# EAGLE design PMB (EAGLE 6.6.0)
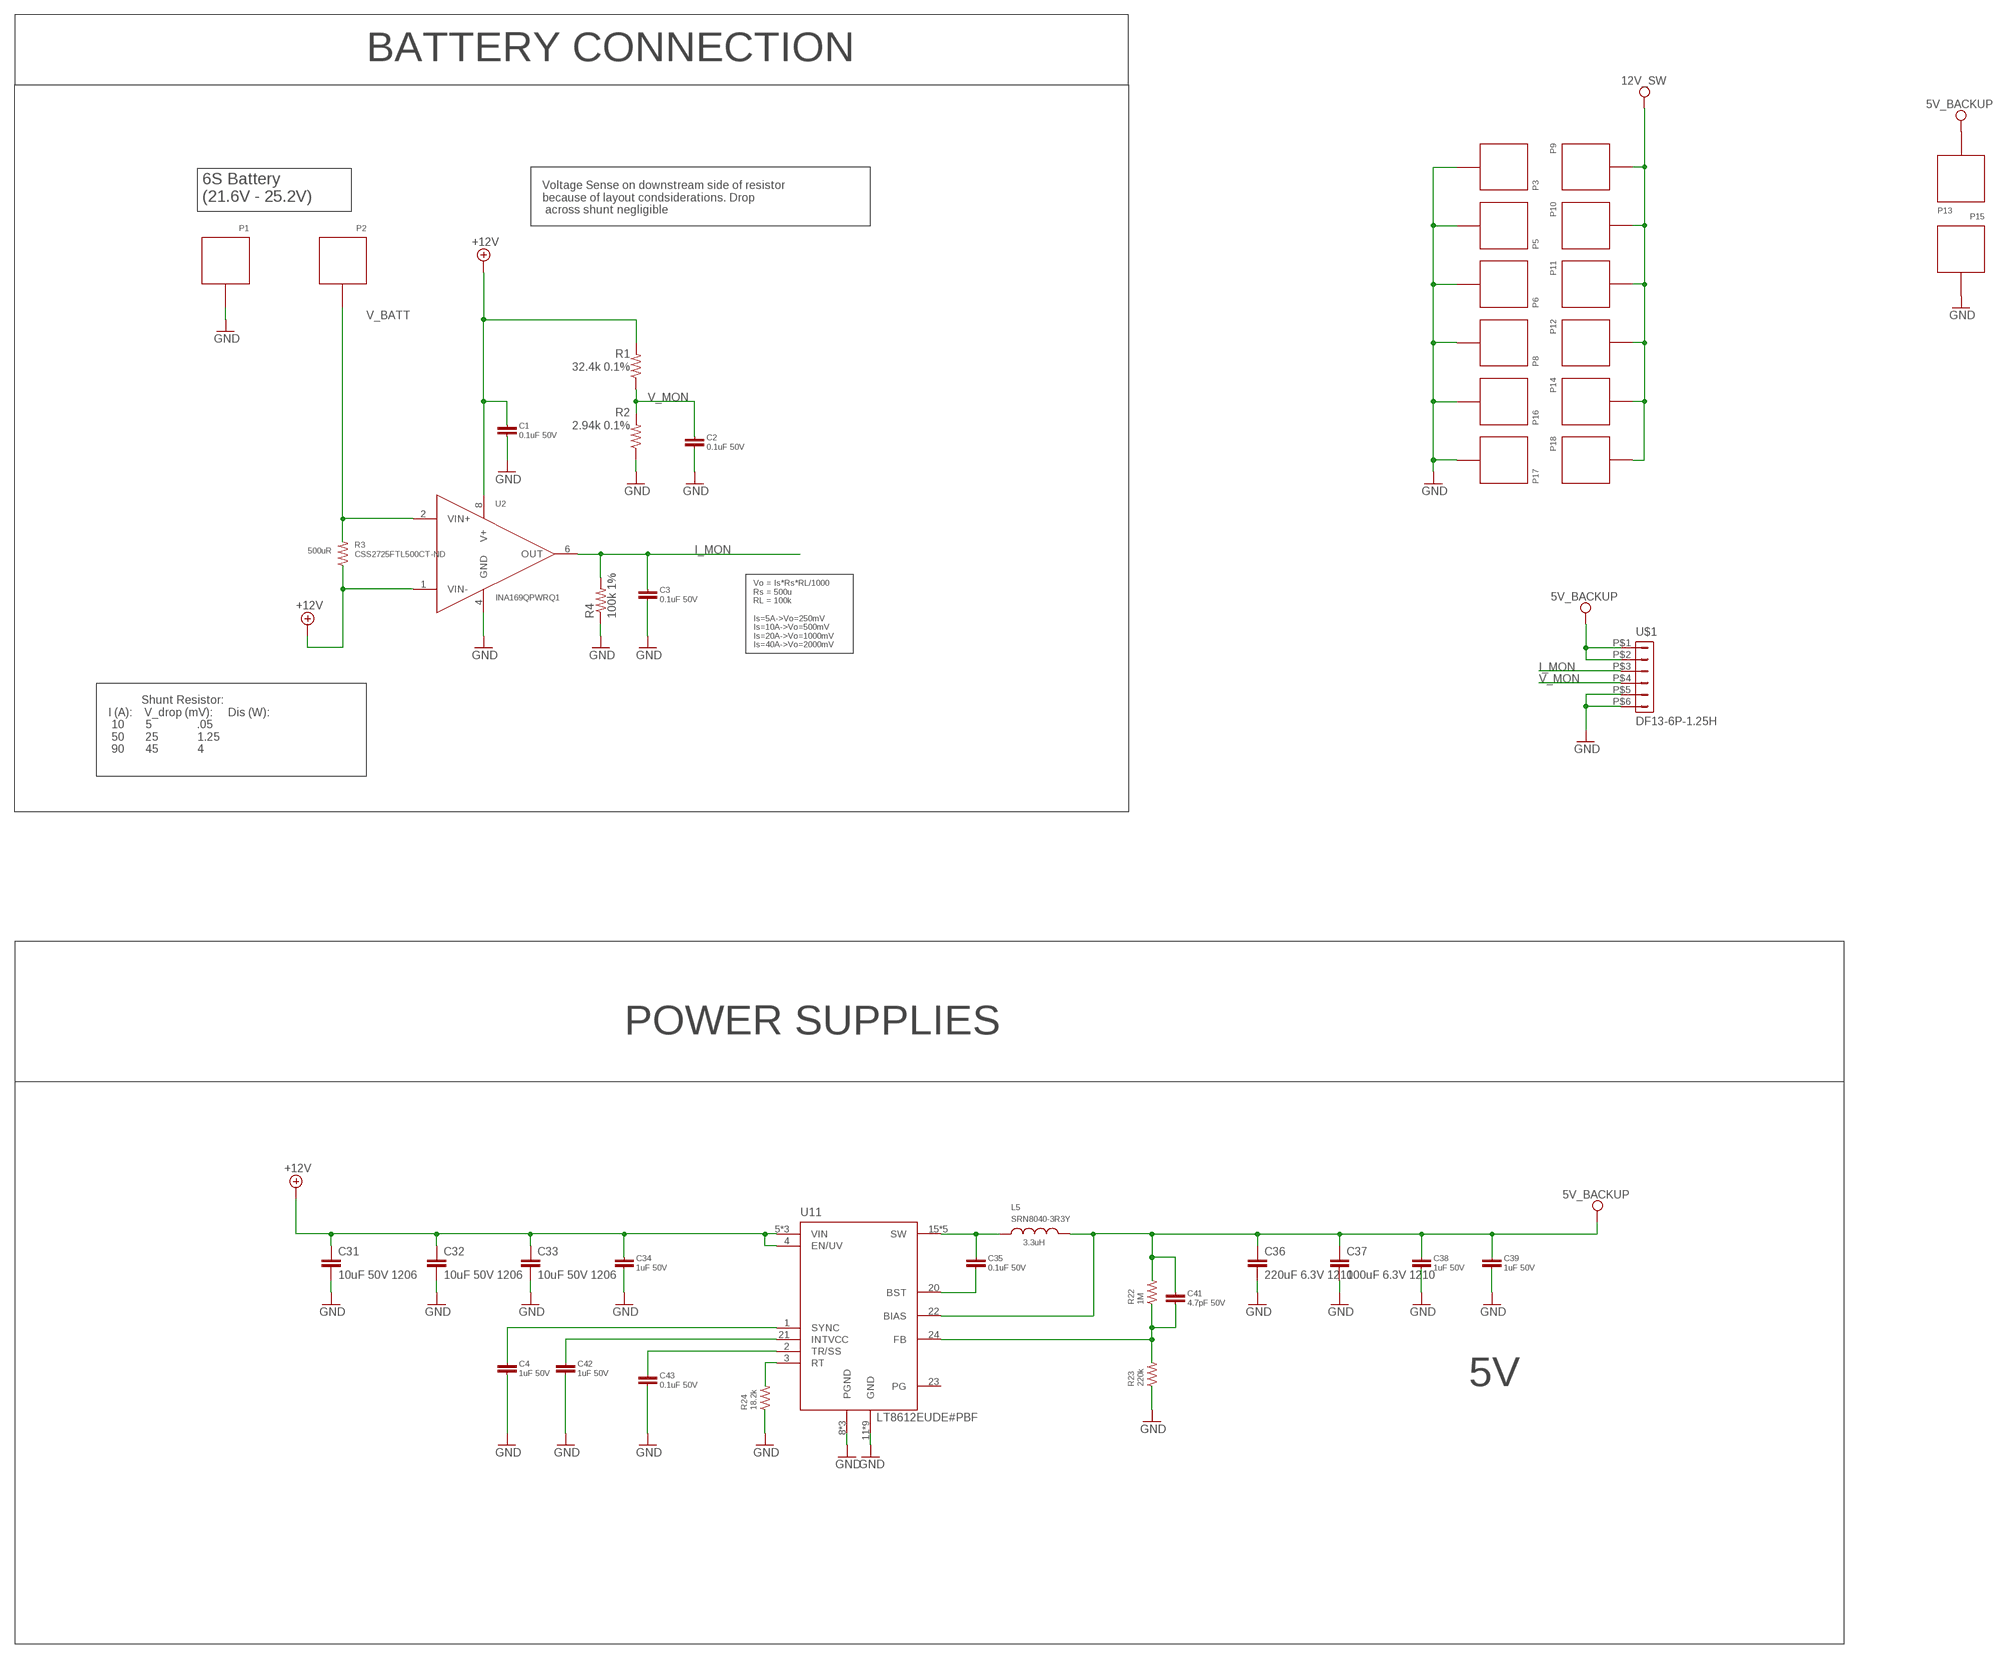
[diagram p0: schematic, sheet 1, part 1 of 2]
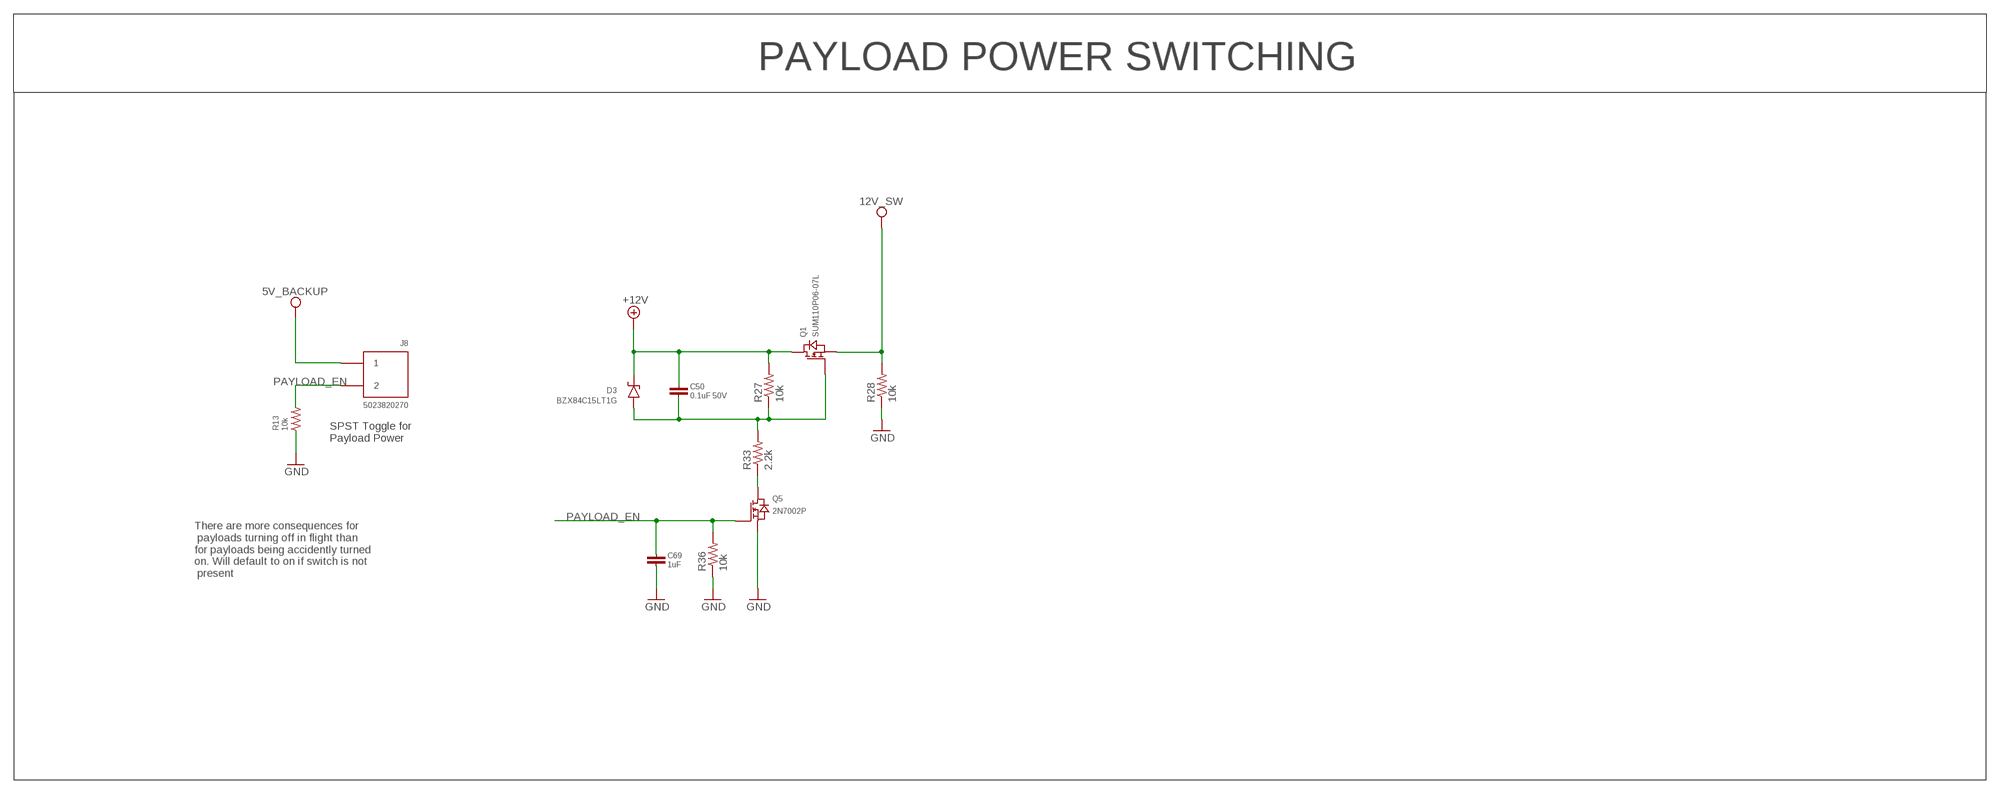
[diagram p1: schematic, sheet 1, part 2 of 2]

## Parts
C1  0.1uF 50V  CAP_(4)  [0805]
C2  0.1uF 50V  CAP_(4)  [0805]
C3  0.1uF 50V  CAP_(4)  [0805]
C4  1uF 50V  CAP_(4)  [0805]
C31  10uF 50V 1206  CAP1206  [1206]
C32  10uF 50V 1206  CAP1206  [1206]
C33  10uF 50V 1206  CAP1206  [1206]
C34  1uF 50V  CAP_(4)  [0805]
C35  0.1uF 50V  CAP_(4)  [0805]
C36  220uF 6.3V 1210  CAP1210  [1210]
C37  100uF 6.3V 1210  CAP1210  [1210]
C38  1uF 50V  CAP_(4)  [0805]
C39  1uF 50V  CAP_(4)  [0805]
C41  4.7pF 50V  CAP_(4)  [0805]
C42  1uF 50V  CAP_(4)  [0805]
C43  0.1uF 50V  CAP_(4)  [0805]
C50  0.1uF 50V  CAP_(4)  [0805]
C69  1uF  CAP_(4)  [0805]
D3  BZX84C15LT1G  ZENER_1A_3C  [SOT-23-3]
J8  5023820270  CON_2PIN_(1)  [CLIK-MATE_1.25MM_2]
L5  SRN8040-3R3Y  INDUCTOR_(B3)  [BOURNS_SRN8040]
P1  SOLDER_PAD_(1)  [SOLDER_PAD_10X5]
P2  SOLDER_PAD_(1)  [SOLDER_PAD_10X5]
P3  SOLDER_PAD_(10)  [SOLDER_PAD_3X6]
P5  SOLDER_PAD_(10)  [SOLDER_PAD_3X6]
P6  SOLDER_PAD_(10)  [SOLDER_PAD_3X6]
P8  SOLDER_PAD_(10)  [SOLDER_PAD_3X6]
P9  SOLDER_PAD_(10)  [SOLDER_PAD_3X6]
P10  SOLDER_PAD_(10)  [SOLDER_PAD_3X6]
P11  SOLDER_PAD_(10)  [SOLDER_PAD_3X6]
P12  SOLDER_PAD_(10)  [SOLDER_PAD_3X6]
P13  SOLDER_PAD_(15)  [SOLDER_PAD_2X4]
P14  SOLDER_PAD_(10)  [SOLDER_PAD_3X6]
P15  SOLDER_PAD_(15)  [SOLDER_PAD_2X4]
P16  SOLDER_PAD_(10)  [SOLDER_PAD_3X6]
P17  SOLDER_PAD_(10)  [SOLDER_PAD_3X6]
P18  SOLDER_PAD_(10)  [SOLDER_PAD_3X6]
Q1  SUM110P06-07L  NMOS_GDS  [TO-263-3_INFINEON]
Q5  2N7002P  NMOS_GSD(1)  [SOT-23-3]
R1  32.4k 0.1%  R-US_R0805  [R0805]
R2  2.94k 0.1%  R-US_R0805  [R0805]
R3  CSS2725FTL500CT-ND  RESISTOR_(4)  [2725]
R4  100k 1%  R-US_R0805  [R0805]
R13  10k  RESISTOR_(7)  [0805]
R22  1M  RESISTOR_(7)  [0805]
R23  220k  RESISTOR_(7)  [0805]
R24  18.2k  RESISTOR_(7)  [0805]
R27  10k  R-US_R0805  [R0805]
R28  10k  R-US_R0805  [R0805]
R33  2.2k  R-US_R0805  [R0805]
R36  10k  R-US_R0805  [R0805]
U2  INA169QPWRQ1  INA169  [TSSOP-8]
U11  LT8612EUDE#PBF  LT8612  [WFQFN-28]
U$1  DF13-6P-1.25H  [DF13A-6P-1.25H]

## Nets
5V_BACKUP: C36.1 C37.1 C38.1 C39.1 C41.1 J8.1 L5.2 P13.P$1 R22.2 U11.22(BIAS) U$1.P$1 U$1.P$2
12V_SW: P9.P$1 P10.P$1 P11.P$1 P12.P$1 P14.P$1 P18.P$1 Q1.3(S) R28.2
+12V: C1.1 C31.1 C32.1 C33.1 C34.1 C50.1 D3.3(C) Q1.2(D) R1.2 R3.1 R27.2 U2.1(VIN-) U2.8(V+) U11.4(EN/UV) U11.5(VIN) U11.6(VIN) U11.7(VIN)
GND: C1.2 C2.2 C3.2 C4.2 C31.2 C32.2 C33.2 C34.2 C36.2 C37.2 C38.2 C39.2 C42.2 C43.2 C69.2 P1.1 P3.P$1 P5.P$1 P6.P$1 P8.P$1 P15.P$1 P16.P$1 P17.P$1 Q5.2(S) R2.1 R4.1 R13.1 R23.1 R24.1 R28.1 R36.1 U2.4(GND) U11.8(PGND) U11.9(PGND) U11.10(PGND) U11.11(GND) U11.12(GND) U11.13(GND) U11.14(GND) U11.25(GND) U11.26(GND) U11.27(GND) U11.28(GND) U11.29(GND) U$1.P$5 U$1.P$6
I_MON: C3.1 R4.2 U2.6(OUT) U$1.P$3
N$8: C42.1 U11.21(INTVCC)
N$10: C43.1 U11.2(TR/SS)
N$11: R24.2 U11.3(RT)
N$12: C35.1 L5.1 U11.15(SW) U11.16(SW) U11.17(SW) U11.18(SW) U11.19(SW)
N$13: C35.2 U11.20(BST)
N$16: C41.2 R22.1 R23.2 U11.24(FB)
N$41: C4.1 U11.1(SYNC)
N$92: C50.2 D3.1(A) Q1.1(G) R27.1 R33.2
N$94: Q5.3(D) R33.1
PAYLOAD_EN: C69.1 J8.2 Q5.1(G) R13.2 R36.2
V_BATT: P2.1 R3.2 U2.2(VIN+)
V_MON: C2.1 R1.1 R2.2 U$1.P$4
Unconnected: U11.23(PG)

## Notes on the sheet
- BATTERY CONNECTION
- 6S Battery
  (21.6V - 25.2V)
- Voltage Sense on downstream side of resistor 
  because of layout condsiderations. Drop
   across shunt negligible
- 500uR
- Vo = Is*Rs*RL/1000
  Rs = 500u
  RL = 100k
  
  Is=5A->Vo=250mV
  Is=10A->Vo=500mV
  Is=20A->Vo=1000mV
  Is=40A->Vo=2000mV
- Shunt Resistor:
  I (A):    V_drop (mV):     Dis (W):
   10       5               .05
   50       25             1.25
   90       45             4
- POWER SUPPLIES
- 3.3uH
- 5V
- PAYLOAD POWER SWITCHING
- SPST Toggle for
  Payload Power
- There are more consequences for
   payloads turning off in flight than 
  for payloads being accidently turned 
  on. Will default to on if switch is not
   present

## Library data of the parts
C1-C4 C34 C35 C38 C39 C41-C43 C50 C69 = dan:CAP
C31-C33 C36 C37 = SparkFun-Capacitors:CAP: Capacitor Standard 0603 ceramic capacitor, and 0.1" leaded capacitor.
D3 = dan:ZENER
J8 = dan:CON_2PIN
L5 = dan:INDUCTOR
P1-P3 P5 P6 P8-P18 = dan:SOLDER_PAD
Q1 Q5 = dan:NMOS
R1 R2 R4 R27 R28 R33 R36 = resistor:R-US_: RESISTOR, American symbol
R3 R13 R22-R24 = dan:RESISTOR
U2 = dan:INA169
U11 = dan:LT8612
U$1 = con-hirose-df13:DF13-6P-1.25: DF13-6P 1.25mm Pitch Miniature Crimping Connector.

## Board
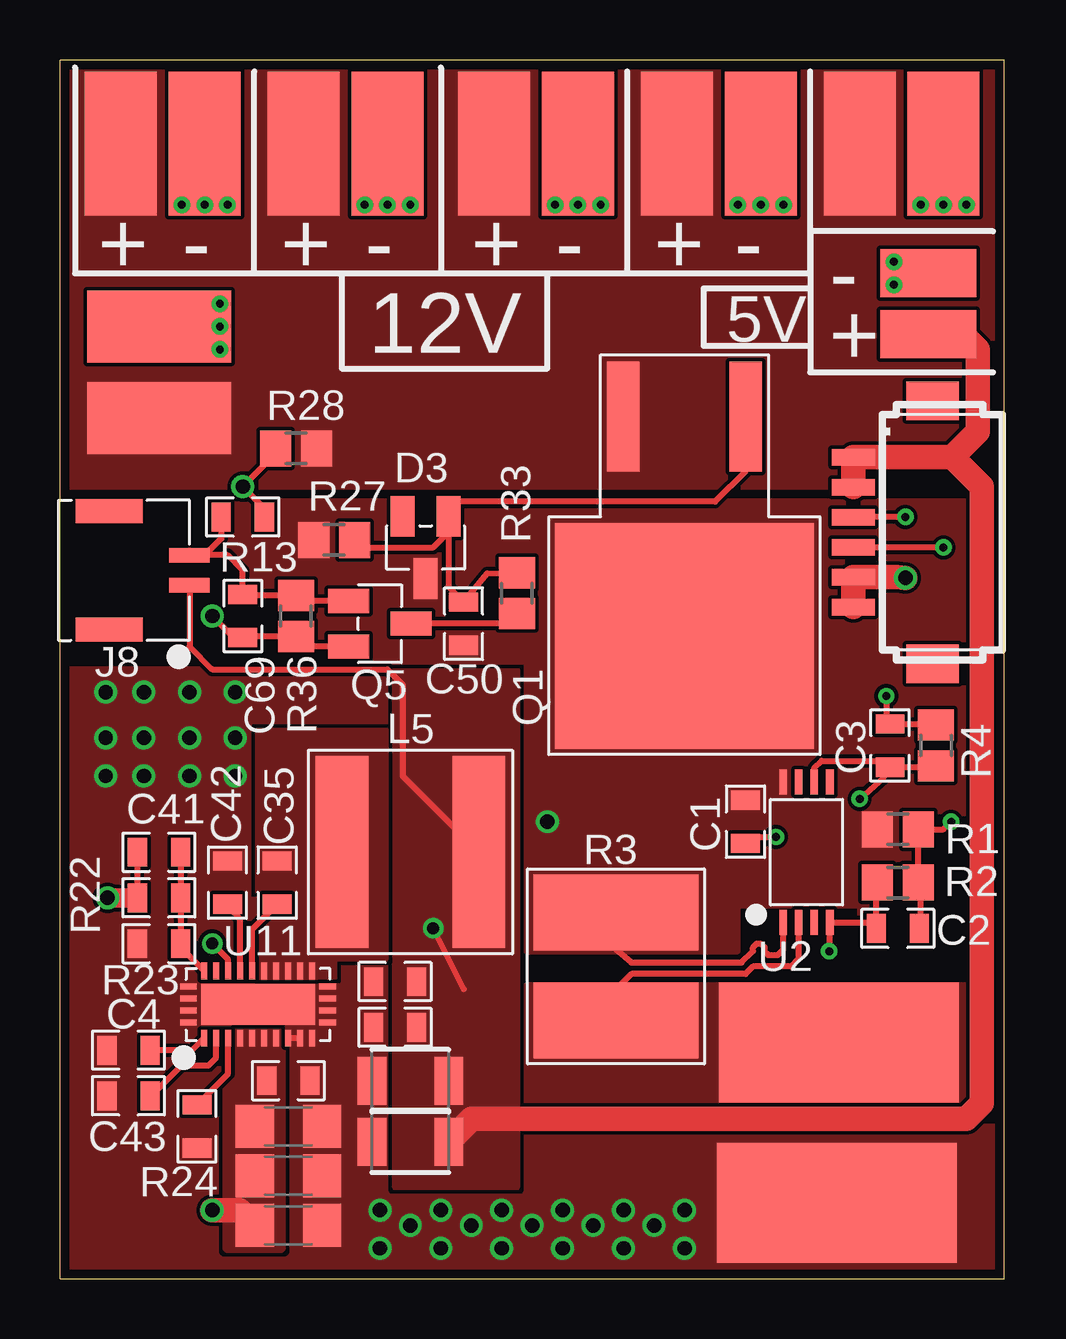
[diagram p2: board, top side]
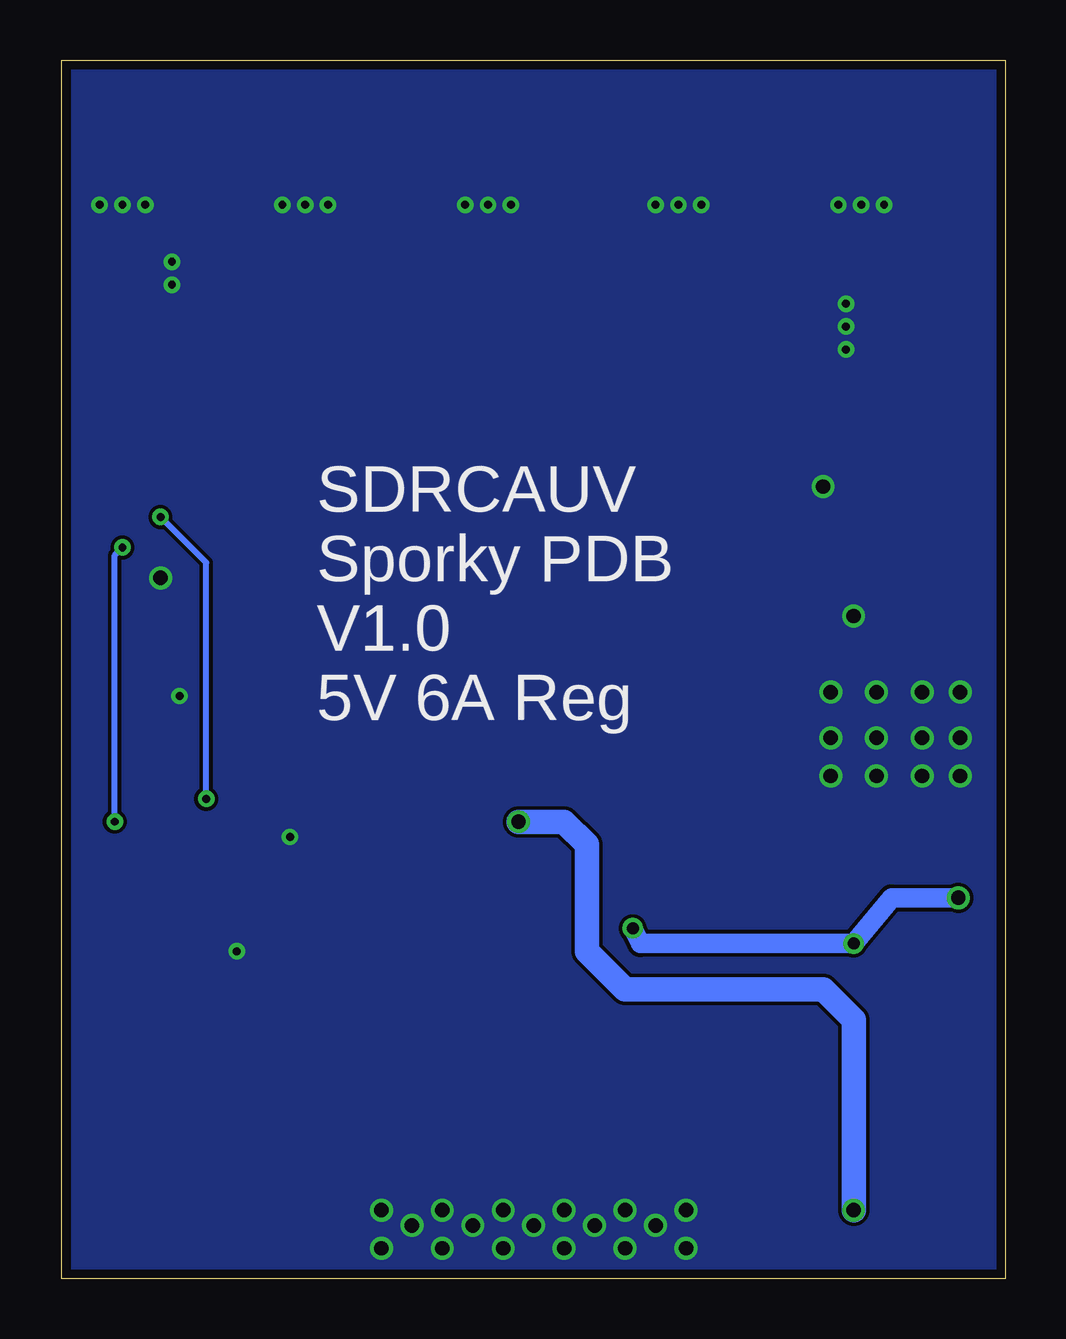
[diagram p3: board, bottom side, seen from below]

Size 39.37 x 50.8 mm. Coordinates in mm from the lower left corner, seen from the top.
Outline: 0,0 39.37,0 39.37,50.8 0,50.8 0,0
Copper layers (1*16): Top 0.0356mm / dielectric 1.5011mm / Bottom 0.0356mm
Design rules "OshPark_2layer": minimum track width 6mil, minimum drill 13mil, track to track 6mil, track to pad 6mil, pad to pad 6mil, via to via 6mil, smd to smd 6mil, copper to edge 15mil, drill to drill 6mil, minimum pad ring 7mil, minimum via ring 7mil, stop-mask expansion 3mil, vias tented up to drill 0mil, thermal gap 10mil

### Footprints (pad centres in the part's own frame; a part is rotated, then mirrored left to right if it is on the bottom)
0805 = smd 0.8 x 1.2: 1 -0.9,0; 2 0.9,0
1206 = smd 1.6 x 1.8: 1 -1.4,0; 2 1.4,0
1210 = smd 1.2 x 2: 1 -1.6,0; 2 1.6,0
SOT-23-3 = smd 1 x 1.7: 1 0.95,1.3; 2 -0.95,1.3; 3 0,-1.3
CLIK-MATE_1.25MM_2 = smd 0.6 x 1.7: 1 -0.625,0; 2 0.625,0 | smd 1 x 2.8: P$1 -2.475,3.35; P$2 2.475,3.35
BOURNS_SRN8040 = smd 2.2 x 8: 1 -2.85,0; 2 2.85,0
SOLDER_PAD_10X5 = smd 10 x 5: 1 0,0
SOLDER_PAD_3X6 = smd 3 x 6: P$1 0,0
SOLDER_PAD_2X4 = smd 2 x 4: P$1 0,0
TO-263-3_INFINEON = smd 4.6 x 1.35: 1 5.775,-2.55; 3 5.775,2.55 | smd 9.4 x 10.8: 2 -3.375,0
R0805 = smd 1.3 x 1.5: 1 -0.85,0; 2 0.85,0
2725 = smd 3.175 x 6.858: 1 -2.248,0; 2 2.248,0
TSSOP-8 = smd 1.05 x 0.32: 1 -2.925,0.975; 2 -2.925,0.325; 3 -2.925,-0.325; 4 -2.925,-0.975; 5 2.925,-0.975; 6 2.925,-0.325; 7 2.925,0.325; 8 2.925,0.975
WFQFN-28 = smd 0.25 x 0.7: 1 -2.25,-1.4; 2 -1.75,-1.4; 3 -1.25,-1.4; 4 -0.75,-1.4; 5 -0.25,-1.4; 6 0.25,-1.4; 7 0.75,-1.4; 8 1.25,-1.4; 9 1.75,-1.4; 10 2.25,-1.4; 15 2.25,1.4; 16 1.75,1.4; 17 1.25,1.4; 18 0.75,1.4; 19 0.25,1.4; 20 -0.25,1.4; 21 -0.75,1.4; 22 -1.25,1.4; 23 -1.75,1.4; 24 -2.25,1.4 | smd 0.7 x 0.25: 11 2.9,-0.75; 12 2.9,-0.25; 13 2.9,0.25; 14 2.9,0.75; 25 -2.9,0.75; 26 -2.9,0.25; 27 -2.9,-0.25; 28 -2.9,-0.75 | smd 4.75 x 1.7: 29 0,0
DF13A-6P-1.25H = smd 1.6 x 2.2: M$0 -5.475,2.4; M$1 5.475,2.4 | smd 0.7 x 1.8: P$1 -3.125,-0.9; P$2 -1.875,-0.9; P$3 -0.625,-0.9; P$4 0.625,-0.9; P$5 1.875,-0.9; P$6 3.125,-0.9

### Placement (x,y rotation side)
C1  28.57,19.05 270 top
C2  34.92,14.61 180 top
C3  34.61,22.23 90 top
C4  2.86,9.53 180 top
C31  9.53,2.22 0 top
C32  9.53,4.29 0 top
C33  9.53,6.35 0 top
C34  9.53,8.26 0 top
C35  9.05,16.51 270 top
C36  14.61,5.71 180 top
C37  14.61,8.26 180 top
C38  13.97,12.38 180 top
C39  13.97,10.48 180 top
C41  4.13,17.78 0 top
C42  6.99,16.51 90 top
C43  2.86,7.62 180 top
C50  16.83,27.3 90 top
C69  7.62,27.62 270 top
D3  15.24,30.48 0 top
J8  5.4,29.53 90 top
L5  14.61,17.78 0 top
P1  32.38,3.17 180 top
P2  32.46,9.84 180 top
P3  29.21,47.31 180 top
P5  4.13,39.69 270 top
P6  13.65,47.31 180 top
P8  6.03,47.31 0 top
P9  33.34,47.31 180 top
P10  18.1,47.31 180 top
P11  25.72,47.31 180 top
P12  4.13,35.88 90 top
P13  36.2,39.37 90 top
P14  10.16,47.31 180 top
P15  36.2,41.91 90 top
P16  36.83,47.31 180 top
P17  21.59,47.31 180 top
P18  2.54,47.31 180 top
Q1  26.04,30.16 90 top
Q5  13.34,27.3 90 top
R1  34.92,18.73 180 top
R2  34.92,16.51 0 top
R3  23.18,13.02 270 top
R4  36.51,22.23 270 top
R13  7.62,31.75 180 top
R22  4.13,15.88 180 top
R23  4.13,13.97 0 top
R24  5.71,6.35 90 top
R27  11.43,30.8 180 top
R28  9.84,34.61 0 top
R33  19.05,28.57 90 top
R36  9.84,27.62 90 top
U2  31.11,17.78 90 top
U11  8.26,11.43 0 top
U$1  33.97,31.11 270 top

### Tracks (layer width: path | path; a pad name or v marks a point on that pad's centre or on a via)
5V_BACKUP  (via drill 0.5, 0.6)
  Top 0.254: C41.1 R22.2 | U11.22 7,13.31 v6.35,13.97 | v15.56,14.61 16.83,12.06 | J8.1 5.4,26.35 6.35,25.4 13.65,25.4 14.29,24.77 14.29,20.95 L5.2
  Top 0.813: v1.98,15.88 R22.2
  Top 1.016: 37.2,34.24 U$1.P$1 U$1.P$2 | 37.2,34.24 38.42,33.02 38.42,7.3 37.78,6.67 17.16,6.67 C36.1 | 37.2,34.24 38.26,35.3 38.26,38.73 37.62,39.37 P13.P$1
  Bottom 0.813: v15.56,14.61 15.24,13.97 v6.35,13.97 4.76,15.88 v1.98,15.88
  pour Top (rank 2, no thermals): 13.97,3.81 13.97,25.4 19.05,25.4 19.05,3.81
12V_SW
  pour Top (no thermals): 0,33.02 39.37,33.02 39.37,65.41 0,65.41
+12V  (via drill 0.6)
  Top 0.254: U2.1 30.14,13.71 29.92,13.49 29.53,13.49 29.37,13.65 29.37,13.81 29.21,13.97 29.05,13.97 28.89,13.81 28.89,13.65 28.42,13.18 23.81,13.18 23.18,13.73 R3.1
  Top 0.813: 7.81,2.54 C31.1
  Top 1.016: v6.35,2.86 7.49,2.86 C31.1
  Bottom 1.016: v20.32,19.05 18.41,19.05 17.46,18.1 17.46,13.65 15.88,12.06 7.62,12.06 6.35,10.79 v6.35,2.86
  pour Top (no thermals): 6.99,1.27 6.99,10.79 9.21,10.79 9.21,1.27
  pour Top (no thermals): 0,25.72 19.45,25.72 19.45,13.65 28.26,13.65 28.26,15.56 33.34,15.56 33.34,13.02 39.37,13.02 39.37,32.38 0,32.38
GND  (via drill 0.33, 0.6)
  Top 0.254: U11.8 U11.9 | v32.07,13.65 32.07,14.83 U2.4 33.77,14.86 C2.2 34.02,16.78 R2.1 | C1.2 28.84,18.41 v29.84,18.41 | C3.2 34.55,23.12 | C3.2 36.46,23.12 R4.1 | v34.45,24.29 34.45,23.28 C3.2 | Q5.2 10.26,26.36 R36.1 7.67,26.77 | 7.67,26.77 C69.2 | 7.67,26.77 7.2,26.77 v6.35,27.62 | R13.1 8.52,32.12 v7.62,33.02 8.99,34.39 R28.1 | P8.P$1 v6.03,44.77 | v13.65,44.77 P6.P$1 | v21.59,44.77 P17.P$1 | v29.21,44.77 P3.P$1 | v36.83,44.77 P16.P$1 | v34.77,42.39 36.2,42.39 P15.P$1 | P5.P$1 v6.67,39.69
  Top 1.016: v35.24,29.21 34.9,29.24 U$1.P$5 U$1.P$6
  other vias: 13.34,2.86 13.34,1.27 14.61,2.22 15.88,2.86 15.88,1.27 17.14,2.22 18.41,2.86 18.41,1.27 19.68,2.22 20.95,2.86 20.95,1.27 22.23,2.22 23.5,2.86 23.5,1.27 24.77,2.22 26.04,2.86 26.04,1.27 1.91,24.45 3.49,24.45 5.4,24.45 7.3,24.45 1.91,22.54 3.49,22.54 5.4,22.54 7.3,22.54 1.91,20.95 3.49,20.95 5.4,20.95 7.3,20.95 5.08,44.77 6.99,44.77 12.7,44.77 14.61,44.77 28.26,44.77 30.16,44.77 20.64,44.77 22.54,44.77 35.88,44.77 37.78,44.77 34.77,41.43 6.67,40.64 6.67,38.73
  pour Bottom (rank 3, no thermals): 0,65.41 39.37,65.41 39.37,0.32 0,0.32
  pour Top (rank 4, no thermals): 0,25.4 0,0 19.68,0 19.68,25.4
  pour Top (rank 3, no thermals): 19.68,6.35 39.37,6.35 39.37,0 19.68,0
I_MON  (via drill 0.33)
  Top 0.254: R4.2 36.46,21.32 C3.1 34.34,21.59 | U2.6 31.44,21.28 31.75,21.59 34.34,21.59 | 34.34,21.59 34.34,20.9 v33.34,20 | v35.24,31.75 33.08,31.75 U$1.P$3
  Bottom 0.254: v33.34,20 33.34,29.84 v35.24,31.75
N$8
  Top 0.254: U11.21 7.5,14.98 C42.1
N$10
  Top 0.254: 3.81,7.62 5.08,8.89 6.19,8.89 6.51,9.21 U11.2
  Top 0.406: C43.1 3.81,7.62
N$11
  Top 0.254: R24.2 7,8.54 U11.3
N$12
  pour Top (no thermals): 8.26,12.54 8.26,22.86 13.57,22.86 13.57,13.34 11.43,13.34 11.43,12.54
N$13
  Top 0.254: U11.20 8.01,14.57 C35.2
N$16
  Top 0.254: 5.95,12.88 U11.24 4.87,13.97 R23.2 R22.1 C41.2
N$41
  Top 0.254: U11.1 5.5,9.53 C4.1
N$92
  Top 0.254: Q1.1 28.59,33.66 27.3,32.38 16.48,32.38 D3.1 16.19,31.11 | 16.19,31.11 16.19,28.84 C50.2 17.81,29.4 R33.2 | R27.1 12.38,30.8 12.7,30.48 15.55,30.48 16.19,31.11
N$94
  Top 0.254: R33.1 18.95,27.73 18.73,27.3 Q5.3
PAYLOAD_EN
  Top 0.254: Q5.1 10.06,28.25 R36.2 7.67,28.47 C69.1 7.62,29.53 6.99,30.16 6.03,30.16 | 6.03,30.16 5.41,30.16 J8.2 | R13.2 6.72,30.85 6.03,30.16
V_BATT
  Top 0.254: U2.2 30.79,13.33 30.48,13.02 28.89,13.02 28.57,12.7 23.81,12.7 23.18,12.06 R3.2
  pour Top (no thermals): 19.45,12.22 19.45,6.67 39.05,6.67 39.05,12.22
V_MON  (via drill 0.33)
  Top 0.254: C2.1 35.88,14.61 35.88,16.41 R2.2 R1.1 36.83,18.73 v37.15,19.05 | v36.83,30.48 33.08,30.48 U$1.P$4
  Bottom 0.254: v37.15,19.05 37.15,30.16 v36.83,30.48

### Text on the board
tPlace: + | - | + | - | + | - | + | - | - | 12V | 5V | +
bPlace: SDRCAUV / Sporky PDB / V1.0 / 5V 6A Reg